# Altium schematic sheet Power.SchDoc: Power
size B; DrawnBy: Jasper Yun; SheetNumber: 2; SheetTotal: 3; Competition: SAC 2021; Subteam: Avionics; University: McGill University; Location: Montreal, Quebec; Project: Avionics Project Name; MRT: McGill Rocket Team
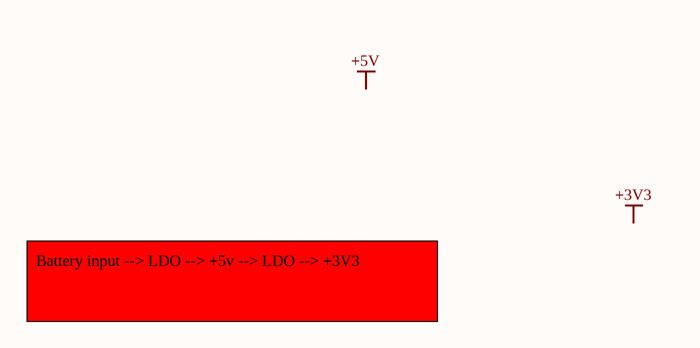
[diagram p0: Power.SchDoc]

## Notes on the sheet
- Battery input --> LDO --> +5v --> LDO --> +3V3
- Labels drawn without touching a wire or pin: +3V3, +5V
- Title
- Size:
- Date:
- B
- Revision:
- Time:
- Drawn By:
- Sheet
- of
- File: